# EasyEDA schematic SCH_5 Li ion battery charger_2022-08-25.json

## Sheets
1 12v to 5v
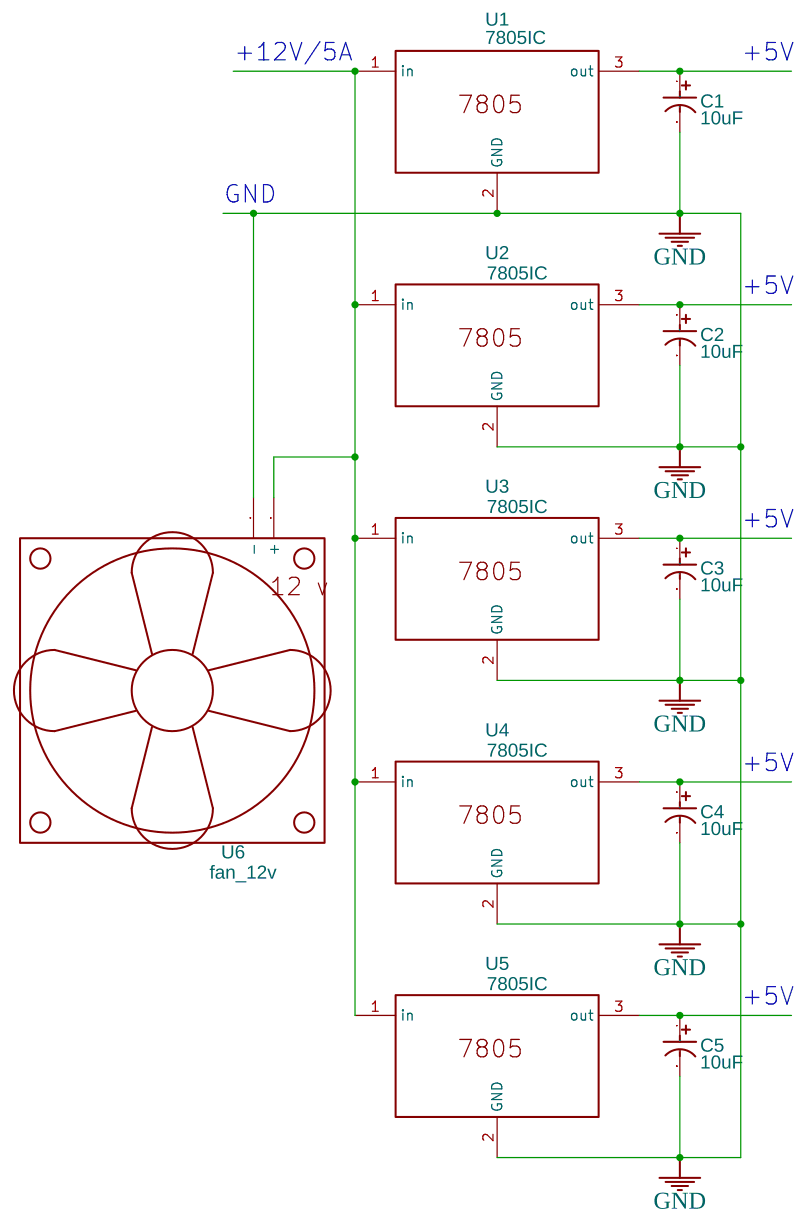
[diagram p0: 12v to 5v]
2 connection with TP4056
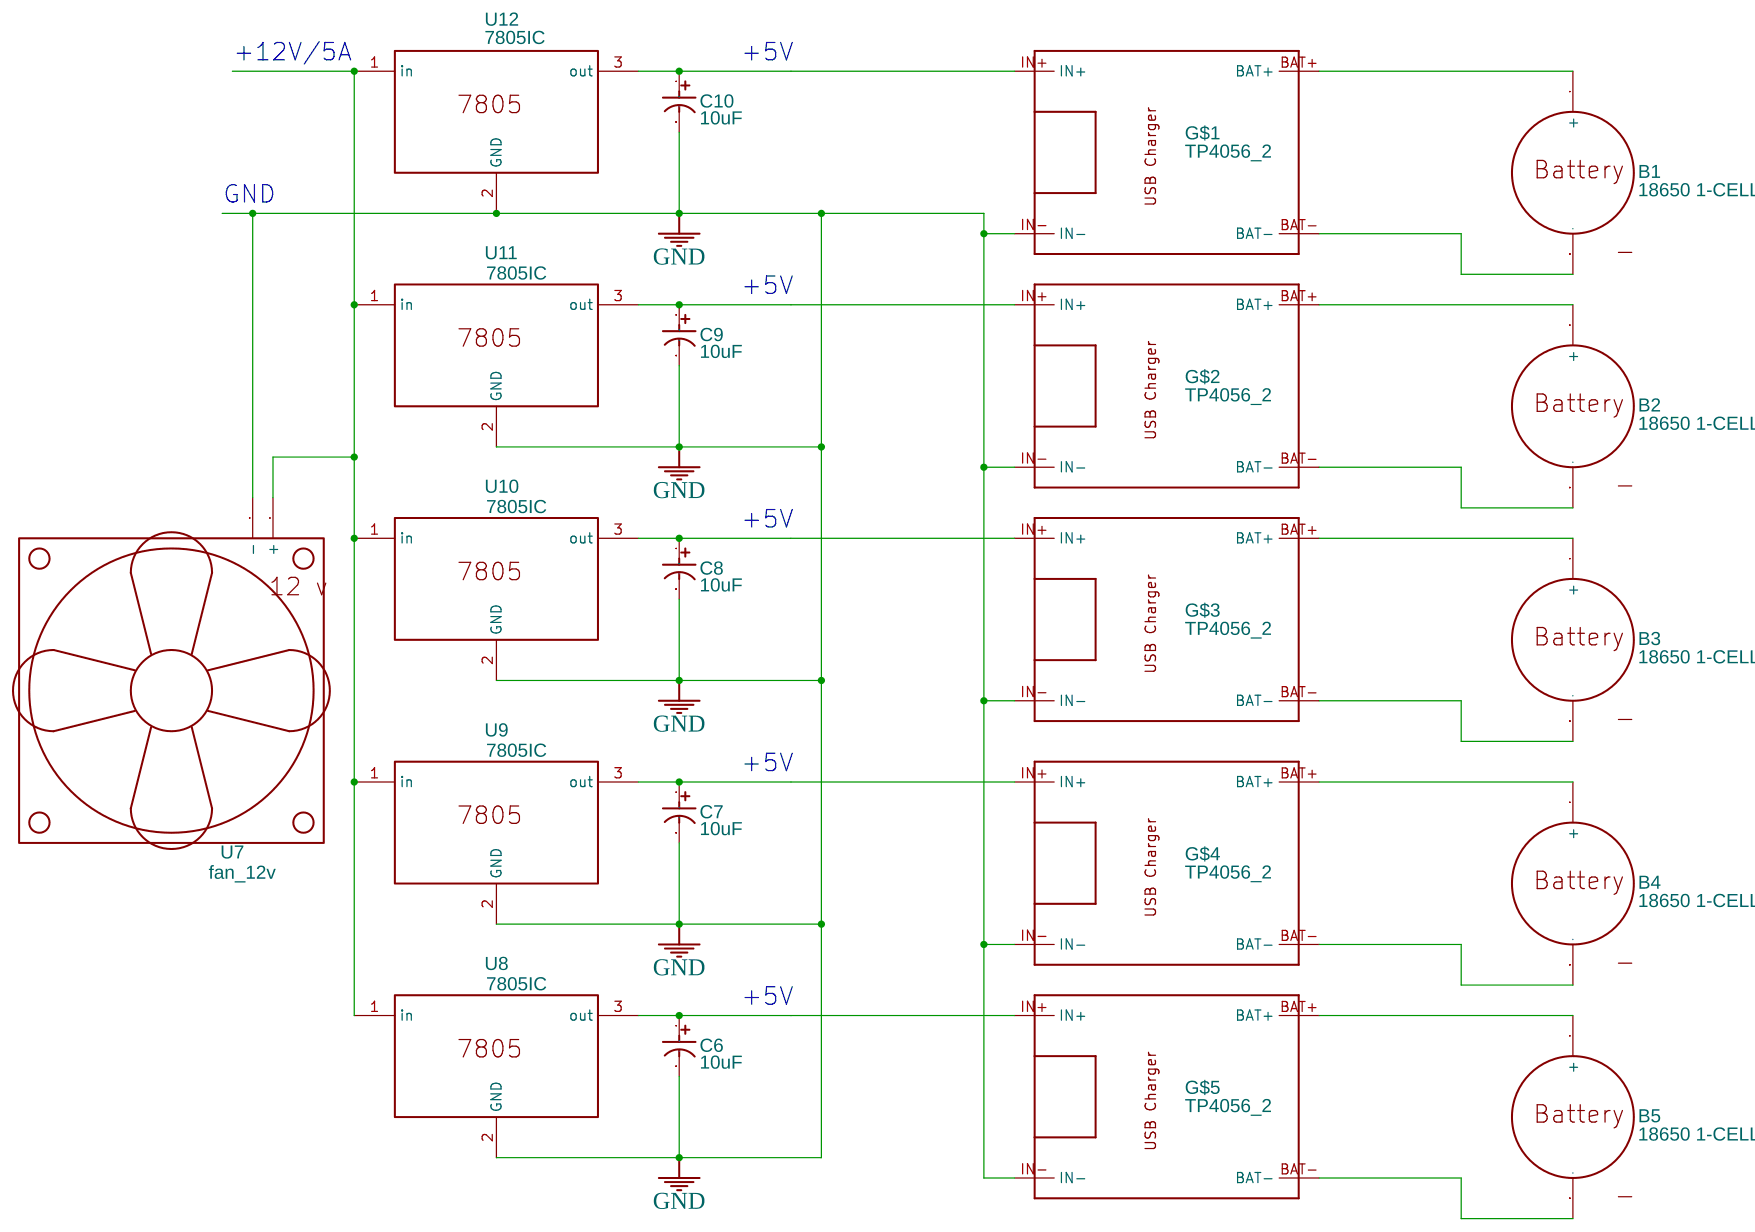
[diagram p1: connection with TP4056]
3 Complete Circuit Diagram
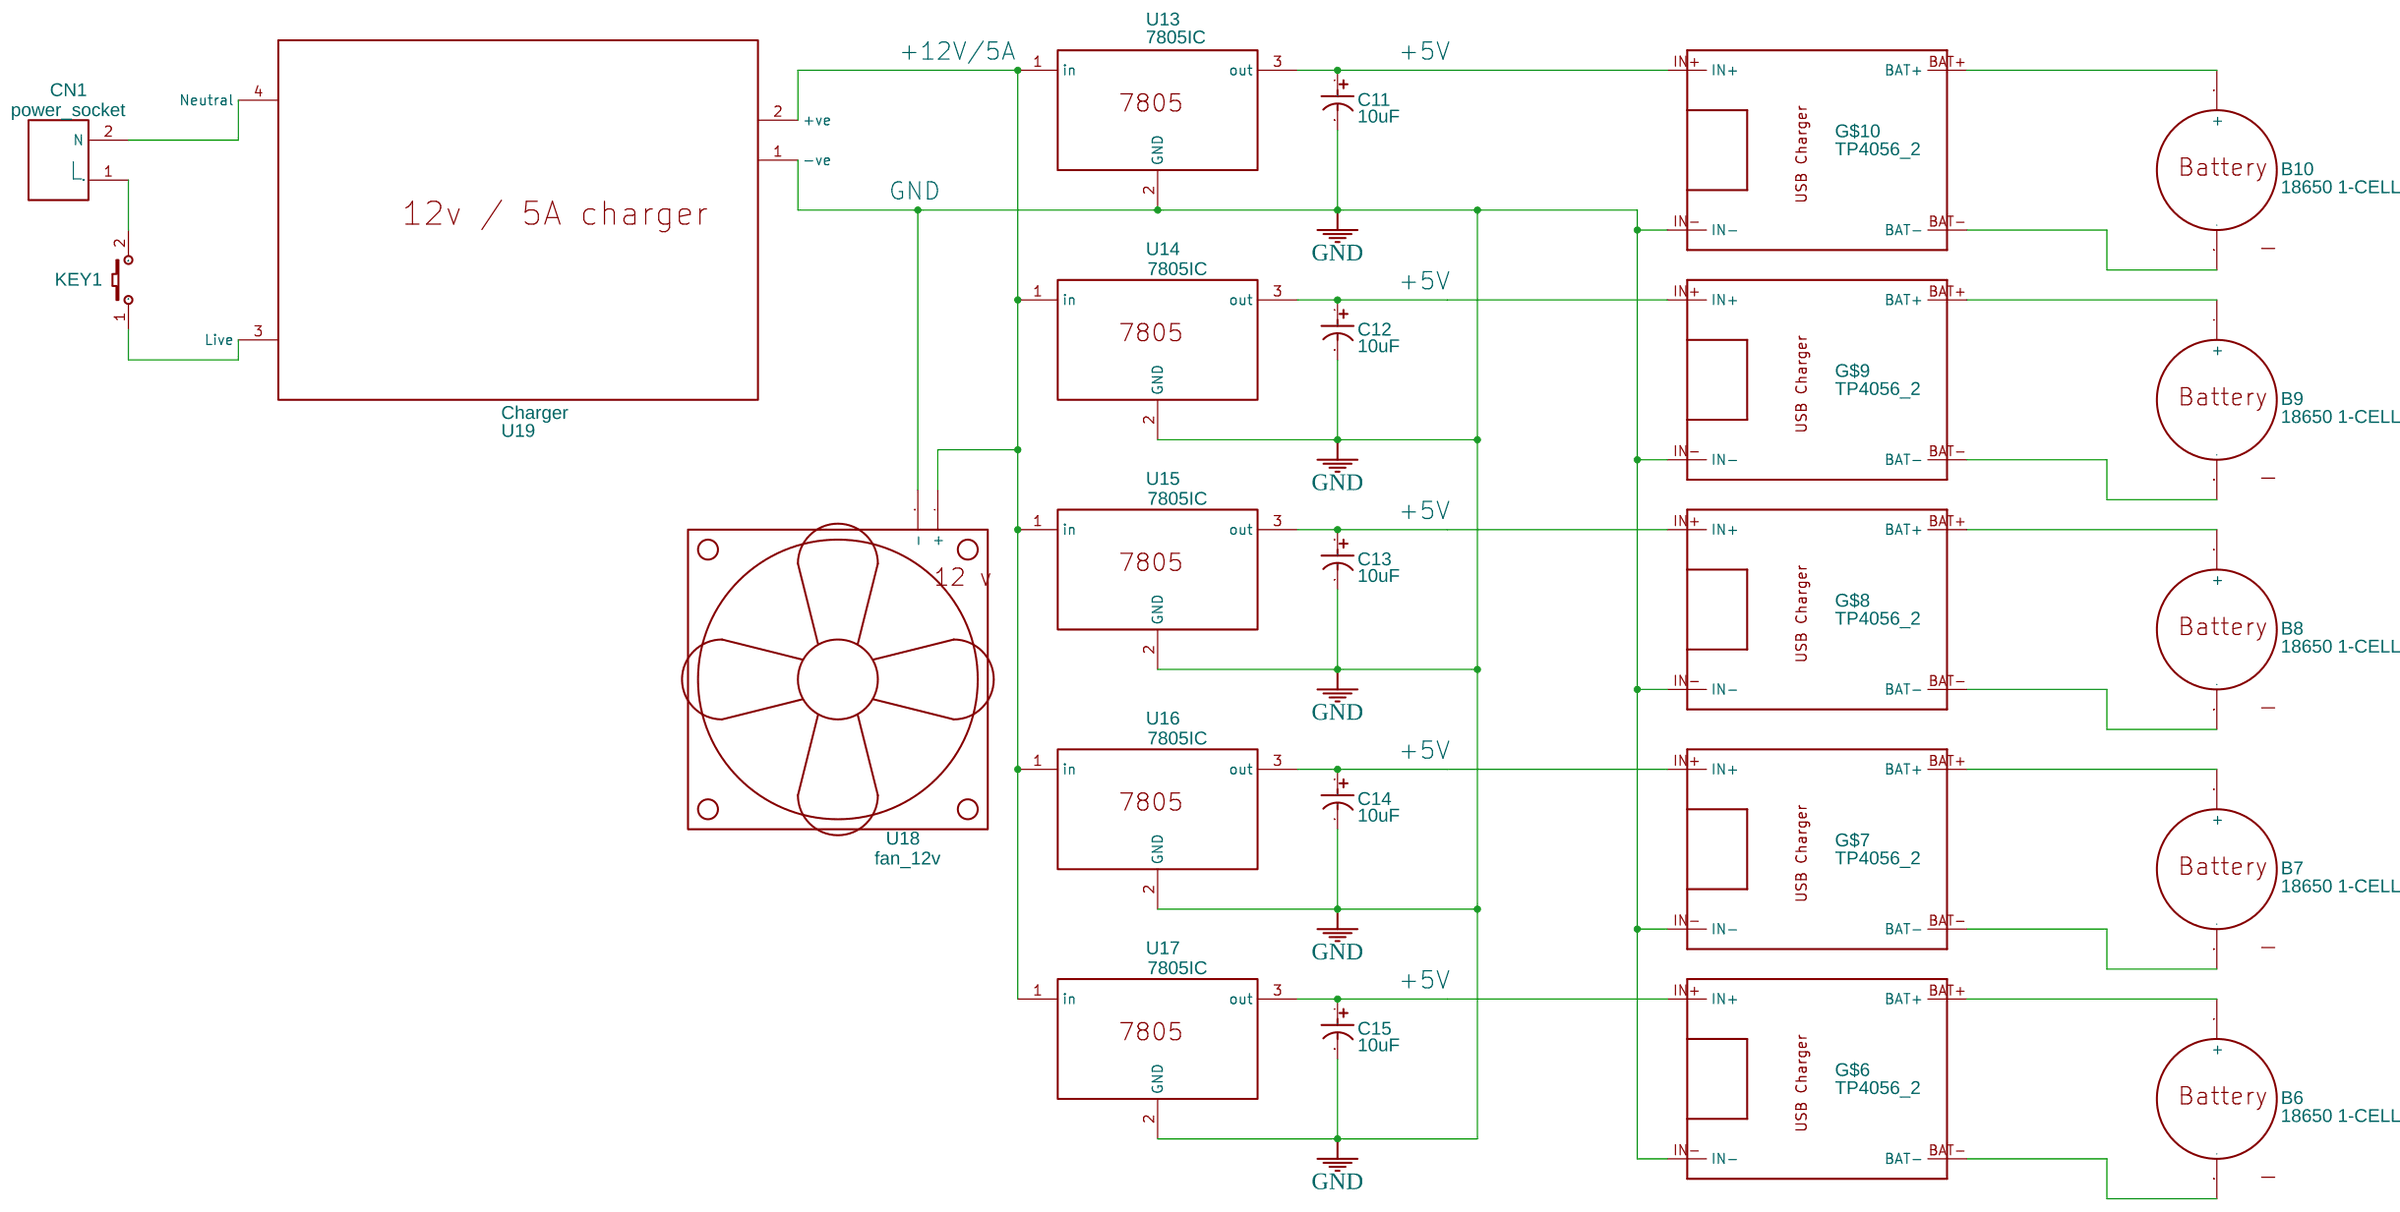
[diagram p2: Complete Circuit Diagram]

## Parts
sheet 12v to 5v
C1  10uF  [CAPACITOR1000UF16V]
C2  10uF  [CAPACITOR1000UF16V]
C3  10uF  [CAPACITOR1000UF16V]
C4  10uF  [CAPACITOR1000UF16V]
C5  10uF  [CAPACITOR1000UF16V]
U1  7805IC  [7805]
U2  7805IC  [7805]
U3  7805IC  [7805]
U4  7805IC  [7805]
U5  7805IC  [7805]
U6  fan_12v  [12V FAN]
sheet Complete Circuit Diagram
B6  18650 1-CELL HOLDER  [18650 1-CELL HOLDER]
B7  18650 1-CELL HOLDER  [18650 1-CELL HOLDER]
B8  18650 1-CELL HOLDER  [18650 1-CELL HOLDER]
B9  18650 1-CELL HOLDER  [18650 1-CELL HOLDER]
B10  18650 1-CELL HOLDER  [18650 1-CELL HOLDER]
C11  10uF  [CAPACITOR1000UF16V]
C12  10uF  [CAPACITOR1000UF16V]
C13  10uF  [CAPACITOR1000UF16V]
C14  10uF  [CAPACITOR1000UF16V]
C15  10uF  [CAPACITOR1000UF16V]
CN1  power_socket  [CONN-TH_SOCKET.BLUE5566-2ANEEDLE]
G$6  TP4056_2  [TP4056]
G$7  TP4056_2  [TP4056]
G$8  TP4056_2  [TP4056]
G$9  TP4056_2  [TP4056]
G$10  TP4056_2  [TP4056]
KEY1  K2-3.6×6.1_SMD  [KEY-SMD_2P-L6.2-W3.6-LS8.0]
U13  7805IC  [7805]
U14  7805IC  [7805]
U15  7805IC  [7805]
U16  7805IC  [7805]
U17  7805IC  [7805]
U18  fan_12v  [12V FAN]
U19  Charger  [CHARGER]
sheet connection with TP4056
B1  18650 1-CELL HOLDER  [18650 1-CELL HOLDER]
B2  18650 1-CELL HOLDER  [18650 1-CELL HOLDER]
B3  18650 1-CELL HOLDER  [18650 1-CELL HOLDER]
B4  18650 1-CELL HOLDER  [18650 1-CELL HOLDER]
B5  18650 1-CELL HOLDER  [18650 1-CELL HOLDER]
C6  10uF  [CAPACITOR1000UF16V]
C7  10uF  [CAPACITOR1000UF16V]
C8  10uF  [CAPACITOR1000UF16V]
C9  10uF  [CAPACITOR1000UF16V]
C10  10uF  [CAPACITOR1000UF16V]
G$1  TP4056_2  [TP4056]
G$2  TP4056_2  [TP4056]
G$3  TP4056_2  [TP4056]
G$4  TP4056_2  [TP4056]
G$5  TP4056_2  [TP4056]
U7  fan_12v  [12V FAN]
U8  7805IC  [7805]
U9  7805IC  [7805]
U10  7805IC  [7805]
U11  7805IC  [7805]
U12  7805IC  [7805]

## Library data of the parts
C1-C15 = CAPACITOR1000UF16V: Supplier: LCSC; Manufacturer: ValuePro; Manufacturer Part: electrolytic capacitor10UF50V; Supplier Part: C32856
U1-U5 U8-U17 = 7805IC: Contributor: 53024
U6 U7 U18 = fan_12v: Contributor: ozgural
B1-B10 = 18650 1-CELL HOLDER: Manufacturer Part: Battery_holder_18650; link: http://cdn-reichelt.de/documents/datenblatt/D600/HA_1X18650_DB.pdf; Contributor: Visionz
CN1 = power_socket: Supplier: LCSC; Manufacturer: BOOMELE; Manufacturer Part: socket.blue5566-2Aneedle; image: //image.lceda.cn/szlcsc/C62133.jpg; Supplier Part: C62133; Contributor: F4IEY
G$1-G$10 = TP4056_2: Contributor: zillawilli
KEY1 = K2-3.6×6.1_SMD: Supplier Part: C118141; Supplier: LCSC; Manufacturer Part: K2-1107ST-A4SW-06; Contributor: LCEDA_Lib; 制造商: 韩国韩荣
U19 = Charger: Contributor: bhaveshkale

## Nets
GND: C1.2(-) C2.2(-) C3.2(-) C4.2(-) C5.2(-) C6.2(-) C7.2(-) C8.2(-) C9.2(-) C10.2(-) C11.2(-) C12.2(-) C13.2(-) C14.2(-) C15.2(-) G$1.IN- G$2.IN- G$3.IN- G$4.IN- G$5.IN- G$6.IN- G$7.IN- G$8.IN- G$9.IN- G$10.IN- U1.2(GND) U2.2(GND) U3.2(GND) U4.2(GND) U5.2(GND) U6.2(-) U7.2(-) U8.2(GND) U9.2(GND) U10.2(GND) U11.2(GND) U12.2(GND) U13.2(GND) U14.2(GND) U15.2(GND) U16.2(GND) U17.2(GND) U18.2(-)
Net-(B1-1): B1.1(+) G$1.BAT+
Net-(B1-2): B1.2(-) G$1.BAT-
Net-(B2-1): B2.1(+) G$2.BAT+
Net-(B2-2): B2.2(-) G$2.BAT-
Net-(B3-1): B3.1(+) G$3.BAT+
Net-(B3-2): B3.2(-) G$3.BAT-
Net-(B4-1): B4.1(+) G$4.BAT+
Net-(B4-2): B4.2(-) G$4.BAT-
Net-(B5-1): B5.1(+) G$5.BAT+
Net-(B5-2): B5.2(-) G$5.BAT-
Net-(B6-1): B6.1(+) G$6.BAT+
Net-(B6-2): B6.2(-) G$6.BAT-
Net-(B7-1): B7.1(+) G$7.BAT+
Net-(B7-2): B7.2(-) G$7.BAT-
Net-(B8-1): B8.1(+) G$8.BAT+
Net-(B8-2): B8.2(-) G$8.BAT-
Net-(B9-1): B9.1(+) G$9.BAT+
Net-(B9-2): B9.2(-) G$9.BAT-
Net-(B10-1): B10.1(+) G$10.BAT+
Net-(B10-2): B10.2(-) G$10.BAT-
Net-(C1-1): C1.1(+) U1.3(out)
Net-(C2-1): C2.1(+) U2.3(out)
Net-(C3-1): C3.1(+) U3.3(out)
Net-(C4-1): C4.1(+) U4.3(out)
Net-(C5-1): C5.1(+) U5.3(out)
Net-(C6-1): C6.1(+) G$5.IN+ U8.3(out)
Net-(C7-1): C7.1(+) G$4.IN+ U9.3(out)
Net-(C8-1): C8.1(+) G$3.IN+ U10.3(out)
Net-(C9-1): C9.1(+) G$2.IN+ U11.3(out)
Net-(C10-1): C10.1(+) G$1.IN+ U12.3(out)
Net-(C11-1): C11.1(+) G$10.IN+ U13.3(out)
Net-(C12-1): C12.1(+) G$9.IN+ U14.3(out)
Net-(C13-1): C13.1(+) G$8.IN+ U15.3(out)
Net-(C14-1): C14.1(+) G$7.IN+ U16.3(out)
Net-(C15-1): C15.1(+) G$6.IN+ U17.3(out)
Net-(CN1-1): CN1.1(Line) KEY1.2
Net-(U1-1): U1.1(in) U2.1(in) U3.1(in) U4.1(in) U5.1(in) U6.1(+)
Net-(U7-1): U7.1(+) U8.1(in) U9.1(in) U10.1(in) U11.1(in) U12.1(in)
Net-(U13-1): U13.1(in) U14.1(in) U15.1(in) U16.1(in) U17.1(in) U18.1(+)

Not connected (* = marked no-connect by the designer): CN1 2(N); KEY1 1; U19 1(-ve) 2(+ve) 3(Live) 4(Neutral)

## Notes on the sheets
sheet 1
- +12V/5A
- +5V
- GND
- +5V
- +5V
- +5V
- +5V
sheet 2
- +12V/5A
- +5V
- GND
- +5V
- +5V
- +5V
- +5V
sheet 3
- +12V/5A
- +5V
- L
- GND
- +5V
- +5V
- +5V
- +5V
